# EAGLE design baremin (EAGLE 6.6.0)
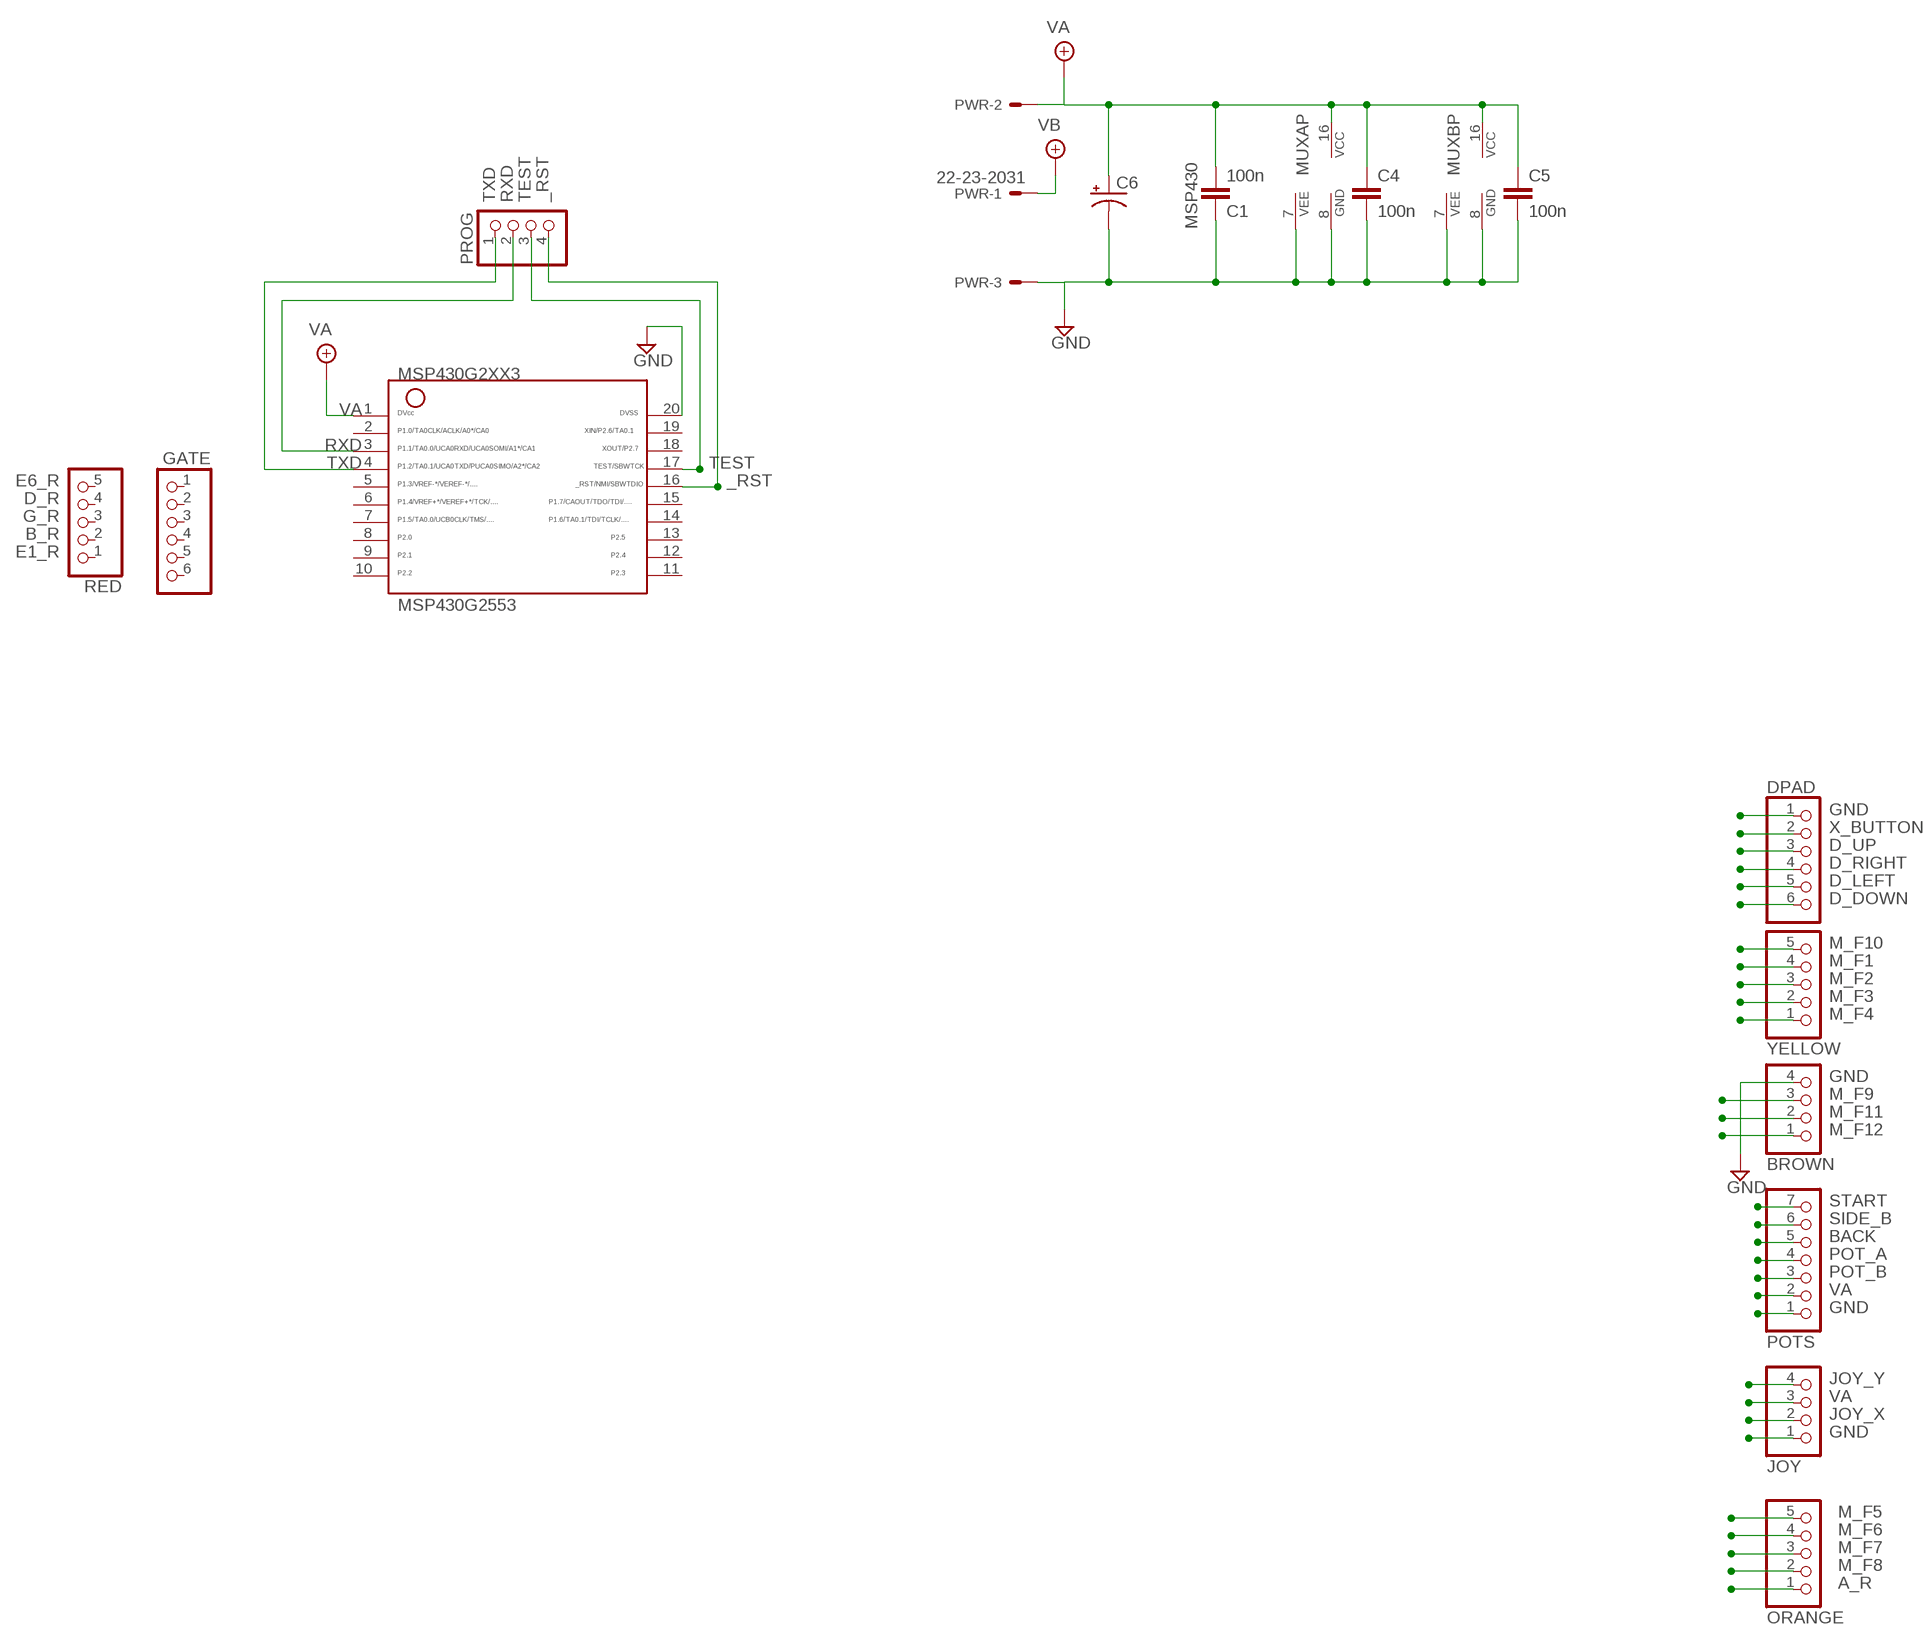
[diagram p0: schematic, sheet 1]

## Parts
BROWN  PINHD-1X4  [1X04]
C1  100n  050X030_050  [050X030_050_3]
C4  100n  050X030_0501  [050X030_050_1]
C5  100n  050X030_050  [050X030_050_3]
C6  0501  [050_020_1]
DPAD  PINHD-1X6  [1X06]
GATE  PINHD-1X6  [1X06]
JOY  PINHD-1X4  [1X04]
MSP430G2553  G2XX3---N20  [N20]
MUXA  4051N  [DIL16]
MUXB  4052N  [DIL16]
ORANGE  PINHD-1X5  [1X05]
POTS  PINHD-1X7  [1X07]
PROG  PINHD-1X4  [1X04]
PWR  22-23-2031  [22-23-2031]
RED  PINHD-1X5  [1X05]
YELLOW  PINHD-1X5  [1X05]

## Nets
_RST: MSP430G2553.16 PROG.4
BACK: POTS.7
D5: ORANGE.1
D_DOWN: DPAD.6
D_LEFT: DPAD.5
D_RIGHT: DPAD.4
D_UP: DPAD.3
GND: BROWN.4 C1.1 C4.2 C5.2 C6.- DPAD.1 JOY.1 MSP430G2553.20 MUXA.7(VEE) MUXA.8(GND) MUXB.7(VEE) MUXB.8(GND) POTS.1 PWR.3
JOY_X: JOY.2
JOY_Y: JOY.4
M_F1: YELLOW.4
M_F2: YELLOW.3
M_F3: YELLOW.2
M_F4: YELLOW.1
M_F5: ORANGE.5
M_F6: ORANGE.4
M_F7: ORANGE.3
M_F8: ORANGE.2
M_F9: BROWN.3
M_F10: YELLOW.5
M_F11: BROWN.2
M_F12: BROWN.1
POT_A: POTS.4
POT_B: POTS.3
RXD: MSP430G2553.3 PROG.2
SIDE_B: POTS.6
START: POTS.5
TEST: MSP430G2553.17 PROG.3
TXD: MSP430G2553.4 PROG.1
VA: C1.2 C4.1 C5.1 C6.+ JOY.3 MSP430G2553.1 MUXA.16(VCC) MUXB.16(VCC) POTS.2 PWR.2
VB: PWR.1
X_BUTTON: DPAD.2
Unconnected: GATE.1 GATE.2 GATE.3 GATE.4 GATE.5 GATE.6 MSP430G2553.2 MSP430G2553.5 MSP430G2553.6 MSP430G2553.7 MSP430G2553.8 MSP430G2553.9 MSP430G2553.10 MSP430G2553.11 MSP430G2553.12 MSP430G2553.13 MSP430G2553.14 MSP430G2553.15 MSP430G2553.18 MSP430G2553.19 MUXA.1(X4) MUXA.2(X6) MUXA.3(X) MUXA.4(X7) MUXA.5(X5) MUXA.6(INH) MUXA.9(C) MUXA.10(B) MUXA.11(A) MUXA.12(X3) MUXA.13(X0) MUXA.14(X1) MUXA.15(X2) MUXB.1(Y0) MUXB.2(Y2) MUXB.3(Y) MUXB.4(Y3) MUXB.5(Y1) MUXB.6(INH) MUXB.9(B) MUXB.10(A) MUXB.11(X3) MUXB.12(X0) MUXB.13(X) MUXB.14(X1) MUXB.15(X2) RED.1 RED.2 RED.3 RED.4 RED.5

## Notes on the sheet
- MSP430
- E6_R
- D_R
- G_R
- B_R
- E1_R
- A_R

## Library data of the parts
BROWN JOY PROG = pinhead:PINHD-1X4: PIN HEADER
C1 C4 C5 = gm-caps-ceramic:050X030_050: 120 - 150pF Xicon Ceramic Disc 5mm lead spacing
C6 = gm-caps-electro-pol:050: 0.22 - 100uF Xicon values at Mouser.com: 10V: 10 - 100uF; 16V: 2.2 - 47uF; 25V: 0.47 - 47uF; 50V: 0.22 - 22uF
DPAD GATE = pinhead:PINHD-1X6: PIN HEADER
MSP430G2553 = TI_MSP430_v16:G2XX3---N20: MSP430G2XX1 PDIP (N) 20 Pin Package
MUXA = 40xx:4051: 8-channel ANALOG MULTIPLEXER
MUXB = 40xx:4052: Dual 4-channel ANALOG MULTIPLEXER
ORANGE RED YELLOW = pinhead:PINHD-1X5: PIN HEADER
POTS = pinhead:PINHD-1X7: PIN HEADER
PWR = jaapie:22-23-2031: .100" (2.54mm) Center Header - 3 Pin; MF: MOLEX; MPN: 22-23-2031; OC_FARNELL: 1462950; OC_NEWARK: 30C0862

## Board
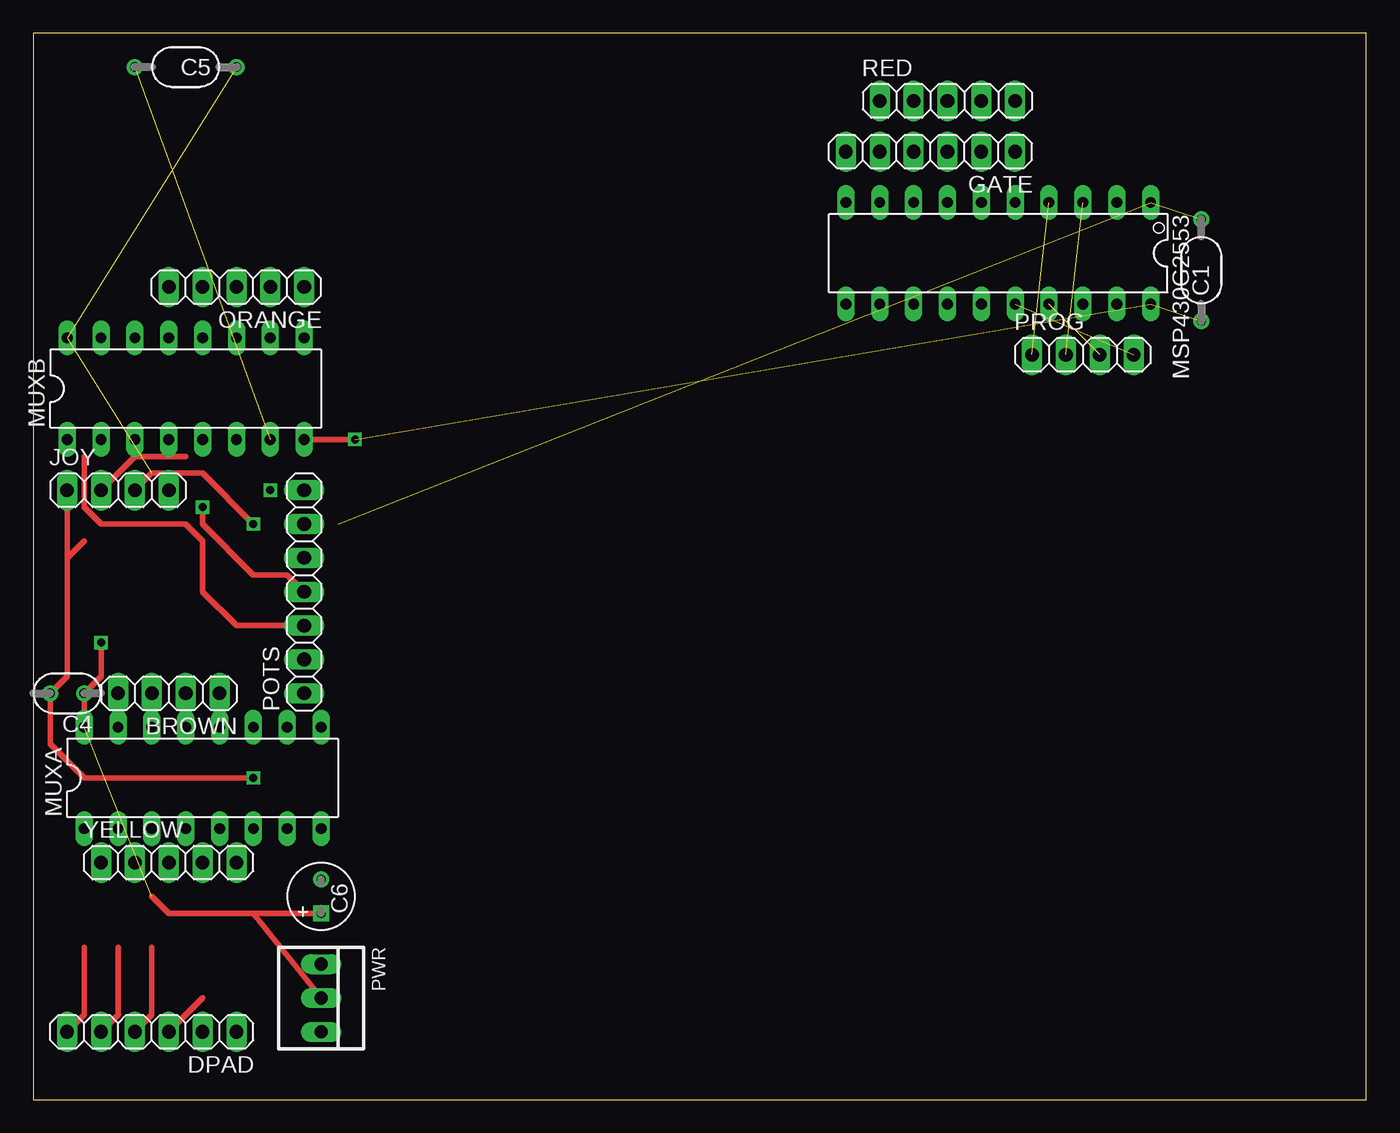
[diagram p1: board, top side]
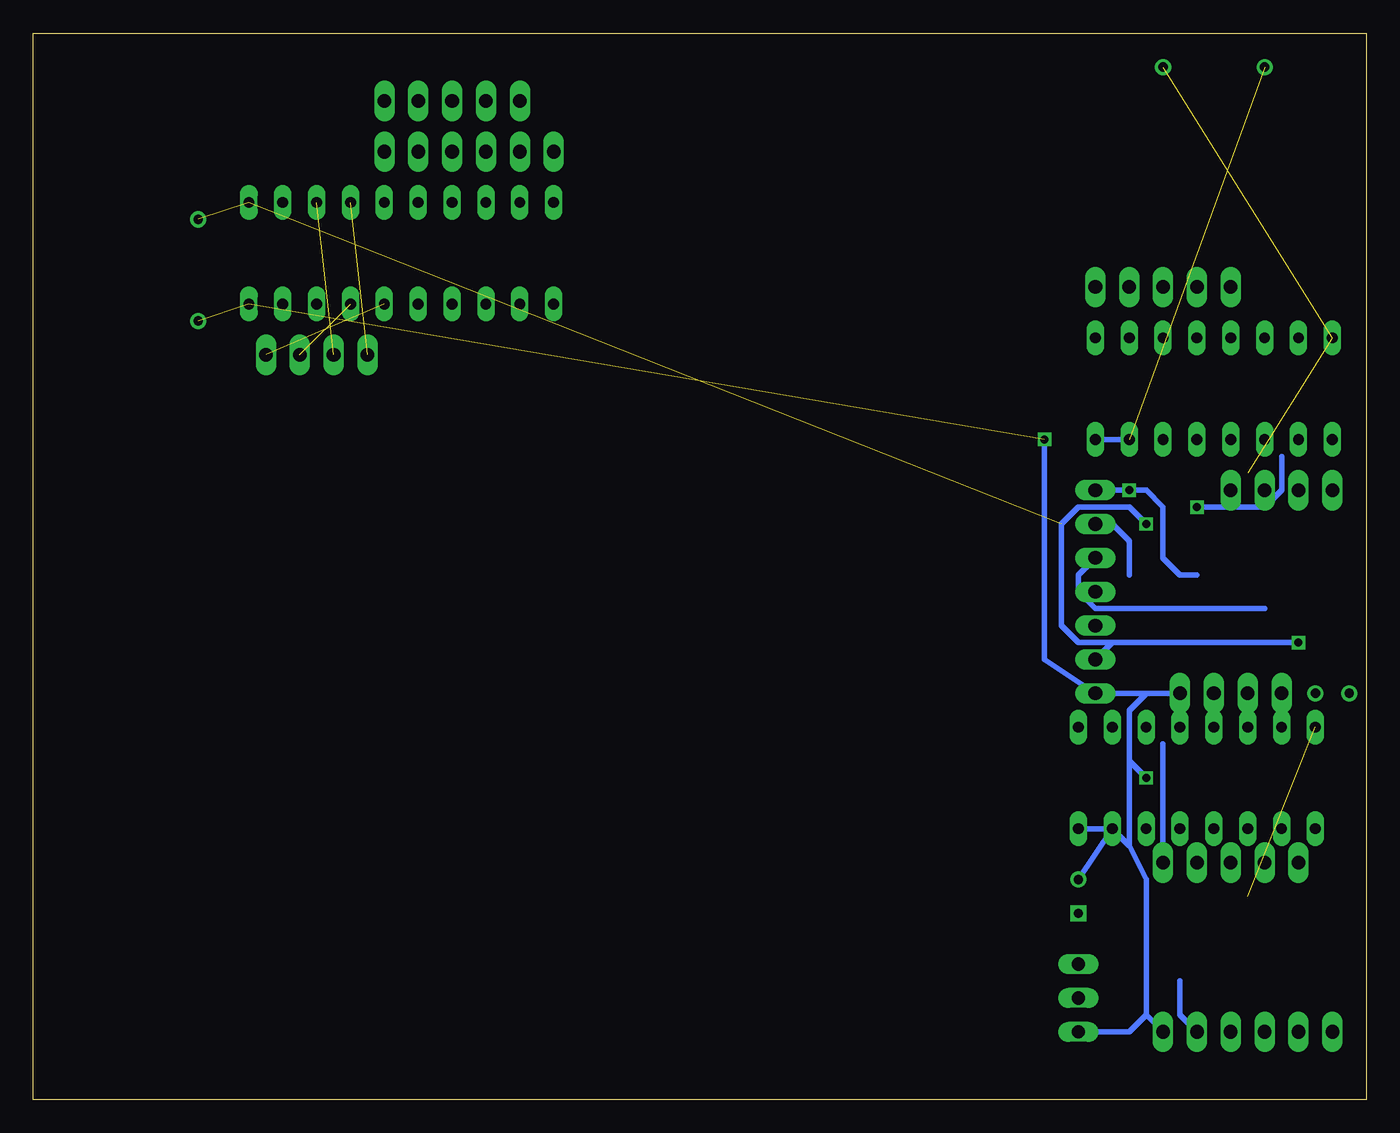
[diagram p2: board, bottom side, seen from below]

Size 100 x 80 mm. Coordinates in mm from the lower left corner, seen from the top.
Outline: 0,0 100,0 100,80 0,80 0,0
Copper layers (1*16): Top 0.035mm / dielectric 1.5mm / Bottom 0.035mm
Design rules "default": minimum track width 10mil, minimum drill 24mil, track to track 8mil, track to pad 8mil, pad to pad 8mil, via to via 8mil, smd to smd 8mil, copper to edge 40mil, drill to drill 8mil, minimum pad ring 10mil, minimum via ring 8mil, stop-mask expansion 4mil, vias tented up to drill 0mil, thermal gap 10mil

### Footprints (pad centres in the part's own frame; a part is rotated, then mirrored left to right if it is on the bottom)
1X04 = drill 1.016 long: 1 -3.81,0; 2 -1.27,0; 3 1.27,0; 4 3.81,0
050X030_050_3 = drill 0.7: 1 -3.81,0; 2 3.81,0
050X030_050_1 = drill 0.7: 1 -1.27,0; 2 1.27,0
050_020_1 = drill 0.7 square: + -1.27,0 | drill 0.7: - 1.27,0
1X06 = drill 1.016 long: 1 -6.35,0; 2 -3.81,0; 3 -1.27,0; 4 1.27,0; 5 3.81,0; 6 6.35,0
N20 = drill 0.813 long: 1 -11.435,-3.81; 2 -8.895,-3.81; 3 -6.355,-3.81; 4 -3.815,-3.81; 5 -1.275,-3.81; 6 1.265,-3.81; 7 3.805,-3.81; 8 6.345,-3.81; 9 8.885,-3.81; 10 11.425,-3.81; 11 11.425,3.81; 12 8.885,3.81; 13 6.345,3.81; 14 3.805,3.81; 15 1.265,3.81; 16 -1.275,3.81; 17 -3.815,3.81; 18 -6.355,3.81; 19 -8.895,3.81; 20 -11.435,3.81
DIL16 = drill 0.813 long: 1 -8.89,-3.81; 2 -6.35,-3.81; 3 -3.81,-3.81; 4 -1.27,-3.81; 5 1.27,-3.81; 6 3.81,-3.81; 7 6.35,-3.81; 8 8.89,-3.81; 9 8.89,3.81; 10 6.35,3.81; 11 3.81,3.81; 12 1.27,3.81; 13 -1.27,3.81; 14 -3.81,3.81; 15 -6.35,3.81; 16 -8.89,3.81
1X05 = drill 1.016 long: 1 -5.08,0; 2 -2.54,0; 3 0,0; 4 2.54,0; 5 5.08,0
1X07 = drill 1.016 long: 1 -7.62,0; 2 -5.08,0; 3 -2.54,0; 4 0,0; 5 2.54,0; 6 5.08,0; 7 7.62,0
22-23-2031 = drill 1 long: 1 -2.54,0; 2 0,0; 3 2.54,0

### Placement (x,y rotation side)
BROWN  10.16,30.48 0 top
C1  87.63,62.23 90 top
C4  2.54,30.48 180 top
C5  11.43,77.47 180 top
C6  21.59,15.24 90 top
DPAD  8.89,5.08 180 top
GATE  67.31,71.12 180 top
JOY  6.35,45.72 0 top
MSP430G2553  72.39,63.5 180 top
MUXA  12.7,24.13 0 top
MUXB  11.43,53.34 0 top
ORANGE  15.24,60.96 180 top
POTS  20.32,38.1 90 top
PROG  78.74,55.88 0 top
PWR  21.59,7.62 270 top
RED  68.58,74.93 0 top
YELLOW  10.16,17.78 180 top

### Tracks (layer width: path | path; a pad name or v marks a point on that pad's centre or on a via)
_RST  (1 unrouted)
BACK  (via drill 0.6)
  Bottom 0.406: POTS.7 v17.78,45.72 16.51,45.72 15.24,44.45 15.24,40.64 13.97,39.37 12.7,39.37
D_DOWN
  Top 0.406: 3.81,11.43 3.81,6.35 DPAD.6
D_LEFT
  Top 0.406: 6.35,11.43 6.35,6.35 DPAD.5
D_RIGHT
  Top 0.406: 8.89,11.43 8.89,6.35 DPAD.4
D_UP
  Top 0.406: DPAD.3 12.7,7.62
GND  (via drill 0.6)  (3 unrouted)
  Top 0.406: v16.51,24.13 3.81,24.13 1.27,26.67 C4.2 2.54,31.75 2.54,40.64 | v24.13,49.53 MUXB.8 | 3.81,41.91 2.54,40.64 | 2.54,40.64 JOY.1
  Bottom 0.406: MUXA.8 MUXA.7 | 17.78,19.05 17.78,25.4 | 17.78,25.4 17.78,29.21 16.51,30.48 | MUXA.7 17.78,19.05 | v16.51,24.13 17.78,25.4 | 16.51,6.35 DPAD.1 | 16.51,6.35 16.51,16.51 17.78,19.05 | BROWN.4 16.51,30.48 | 16.51,30.48 POTS.1 24.13,33.02 v24.13,49.53 | 16.51,6.35 17.78,5.08 PWR.3 | C6.- MUXA.7 | MUXB.7 MUXB.8
JOY_X
  Top 0.406: JOY.2 7.62,48.26 11.43,48.26
M_F4
  Bottom 0.406: 15.24,26.67 YELLOW.1
POT_A  (via drill 0.6)
  Top 0.406: POTS.4 19.05,39.37 16.51,39.37 12.7,43.18 v12.7,44.45
  Bottom 0.406: v12.7,44.45 7.62,44.45 6.35,45.72 6.35,48.26
POT_B
  Top 0.406: POTS.3 15.24,35.56 12.7,38.1 12.7,41.91 11.43,43.18 5.08,43.18 3.81,44.45 3.81,48.26
RXD  (1 unrouted)
SIDE_B
  Bottom 0.406: POTS.6 19.05,43.18 17.78,41.91 17.78,39.37
START
  Bottom 0.406: 7.62,36.83 20.32,36.83 21.59,38.1 21.59,39.37 POTS.5
TEST  (1 unrouted)
TXD  (1 unrouted)
VA  (via drill 0.6)  (5 unrouted)
  Top 0.406: MUXA.16 C4.1 5.08,31.75 v5.08,34.29 | 8.89,15.24 10.16,13.97 16.51,13.97 | 16.51,13.97 PWR.2 | 16.51,13.97 C6.+ | JOY.3 8.89,46.99 12.7,46.99 v16.51,43.18
  Bottom 0.406: v5.08,34.29 19.05,34.29 | POTS.2 19.05,34.29 | 19.05,34.29 21.59,34.29 22.86,35.56 22.86,43.18 21.59,44.45 17.78,44.45 v16.51,43.18
X_BUTTON
  Bottom 0.406: DPAD.2 13.97,6.35 13.97,8.89